# EAGLE design ESPProgrammer (EAGLE 7.7.0)
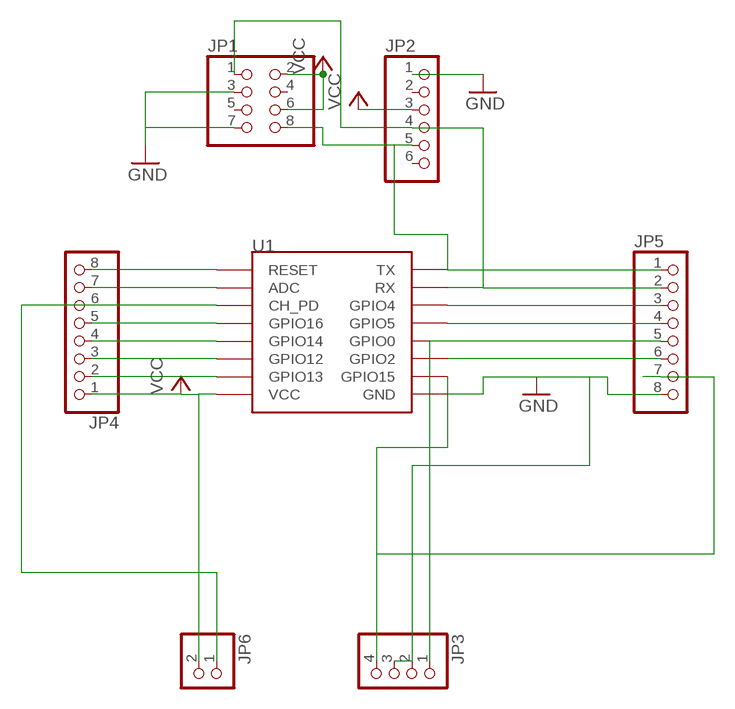
[diagram p0: schematic, sheet 1]

## Parts
JP1  PINHD-2X4  [2X04]
JP2  PINHD-1X6  [1X06]
JP3  PINHD-1X4  [1X04]
JP4  PINHD-1X8  [1X08]
JP5  PINHD-1X8  [1X08]
JP6  PINHD-1X2  [1X02]
U1  ESP12  [ESP12]

## Nets
GND: JP1.3 JP1.7 JP2.1 JP3.2 JP3.3 JP5.8 U1.GND
N$1: JP3.1 JP5.5 U1.GPIO0
N$2: JP3.4 JP5.7 U1.GPIO15
N$3: JP5.3 U1.GPIO4
N$4: JP1.1 JP2.4 JP5.2 U1.RX
N$5: JP1.8 JP2.5 JP5.1 U1.TX
N$6: JP5.4 U1.GPIO5
N$7: JP5.6 U1.GPIO2
N$9: JP4.8 U1.RESET
N$10: JP4.7 U1.ADC
N$11: JP4.5 U1.GPIO16
N$12: JP4.4 U1.GPIO14
N$13: JP4.3 U1.GPIO12
N$14: JP4.2 U1.GPIO13
N$15: JP4.6 JP6.1 U1.CH_PD
VCC: JP1.2 JP1.6 JP2.3 JP4.1 JP6.2 U1.VCC
Unconnected: JP1.4 JP1.5 JP2.2 JP2.6

## Library data of the parts
JP1 = pinhead:PINHD-2X4: PIN HEADER
JP2 = pinhead:PINHD-1X6: PIN HEADER
JP3 = pinhead:PINHD-1X4: PIN HEADER
JP4 JP5 = pinhead:PINHD-1X8: PIN HEADER
JP6 = pinhead:PINHD-1X2: PIN HEADER
U1 = esp8266modules:ESP12: ESP8266 Wifi module 12

## Net classes
0 default: width 0.7 mm, drill 0.6 mm, clearance 0.4 mm

## Board
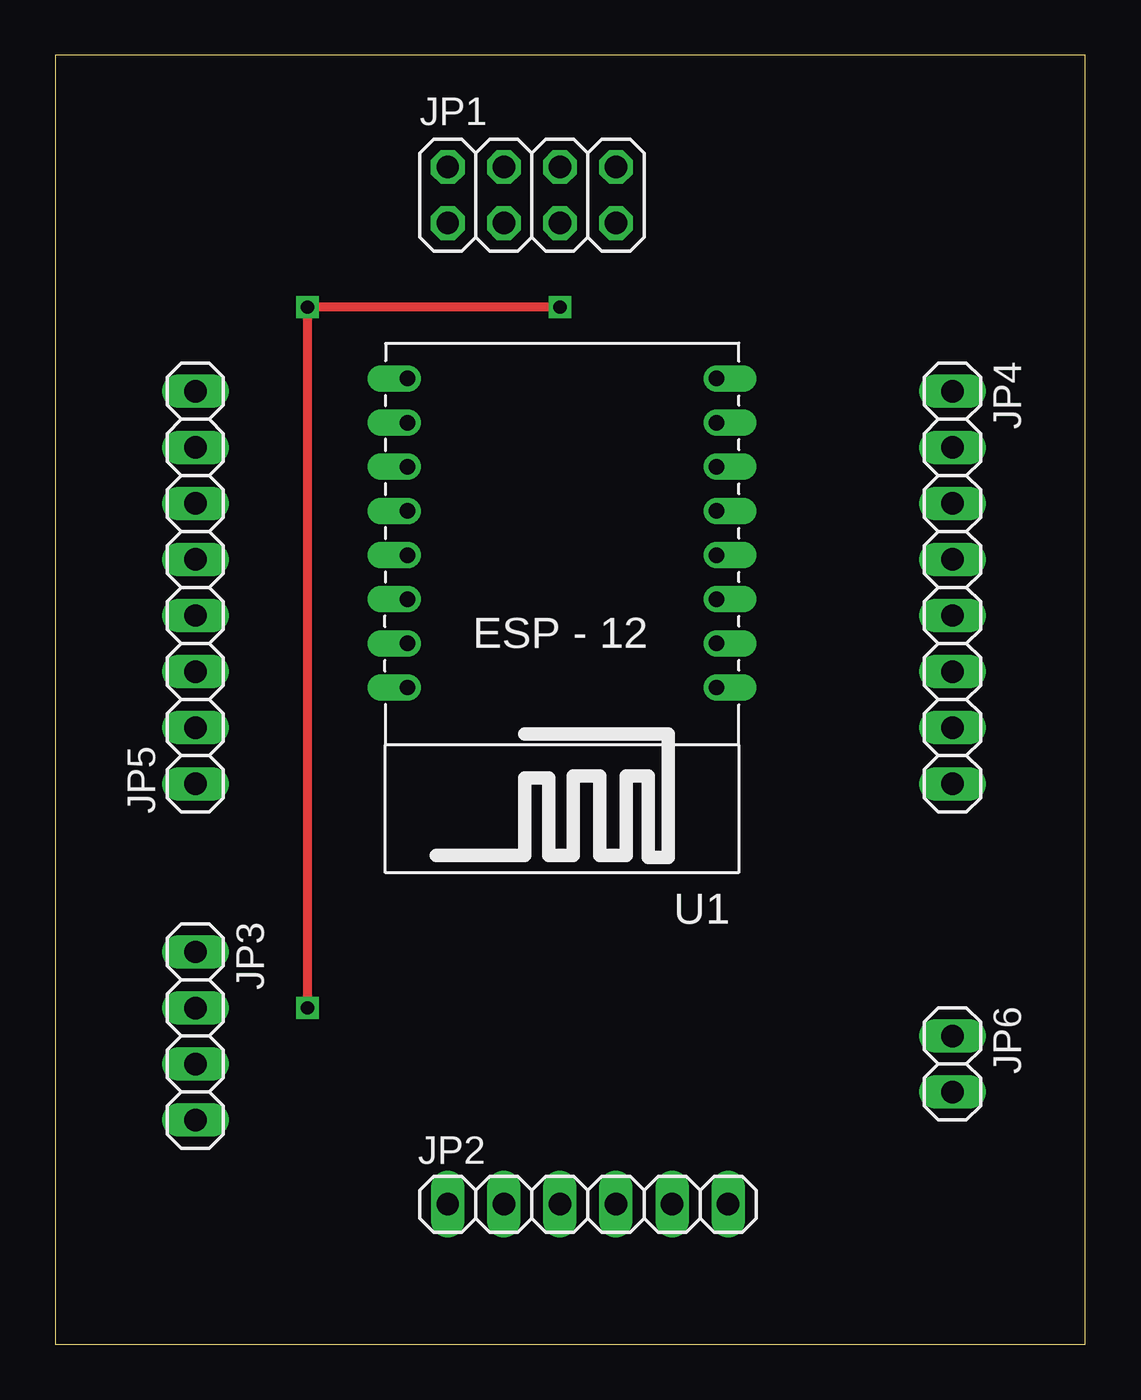
[diagram p1: board, top side]
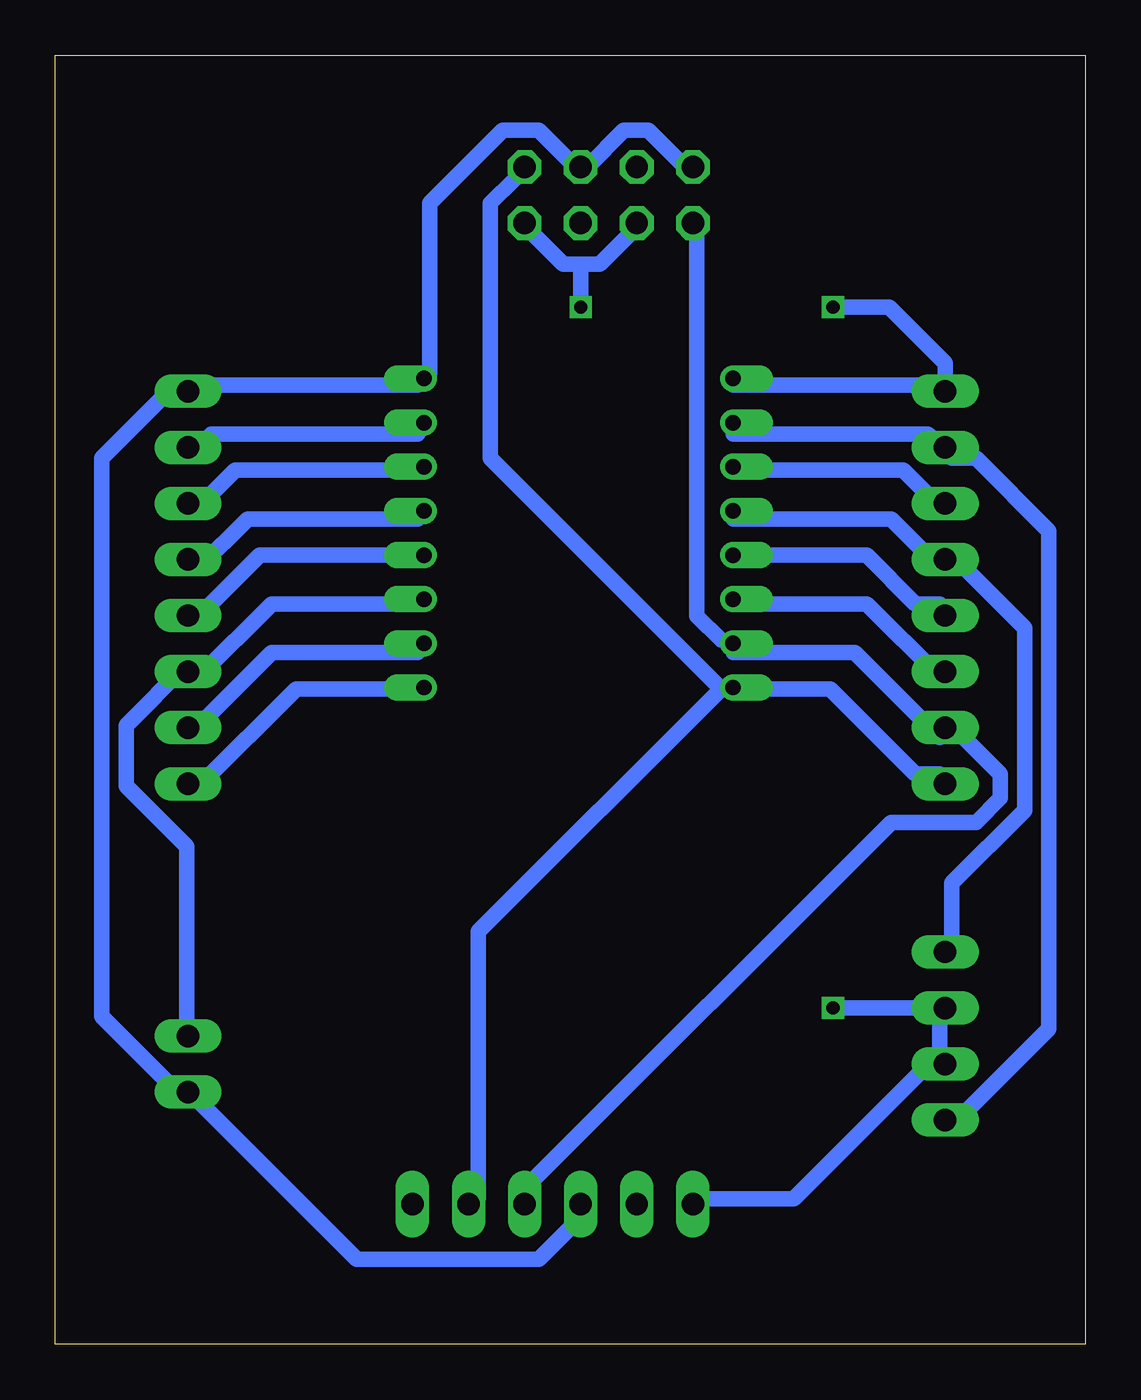
[diagram p2: board, bottom side, seen from below]

Size 46.66 x 58.41 mm. Coordinates in mm from the lower left corner, seen from the top.
Outline: 0,0 46.66,0 46.66,58.41 0,58.41 0,0
Copper layers (1*16): Top 0.035mm / dielectric 1.5mm / Bottom 0.035mm
Design rules "default": minimum track width 10mil, minimum drill 24mil, track to track 8mil, track to pad 8mil, pad to pad 8mil, via to via 8mil, smd to smd 8mil, copper to edge 40mil, drill to drill 8mil, minimum pad ring 10mil, minimum via ring 8mil, stop-mask expansion 4mil, vias tented up to drill 0mil, thermal gap 10mil

### Footprints (pad centres in the part's own frame; a part is rotated, then mirrored left to right if it is on the bottom)
2X04 = drill 1.016 octagon: 1 -3.81,-1.27; 2 -3.81,1.27; 3 -1.27,-1.27; 4 -1.27,1.27; 5 1.27,-1.27; 6 1.27,1.27; 7 3.81,-1.27; 8 3.81,1.27
1X06 = drill 1.016 long: 1 -6.35,0; 2 -3.81,0; 3 -1.27,0; 4 1.27,0; 5 3.81,0; 6 6.35,0
1X04 = drill 1.016 long: 1 -3.81,0; 2 -1.27,0; 3 1.27,0; 4 3.81,0
1X08 = drill 1.016 long: 1 -8.89,0; 2 -6.35,0; 3 -3.81,0; 4 -1.27,0; 5 1.27,0; 6 3.81,0; 7 6.35,0; 8 8.89,0
1X02 = drill 1.016 long: 1 -1.27,0; 2 1.27,0
ESP12 = drill 0.7 offset: ADC -7.1,3.8; CH_PD -7.1,1.8; GND 6.9,-8.2; GPIO0 6.9,-2.2; GPIO2 6.9,-4.2; GPIO4 6.9,1.8; GPIO5 6.9,-0.2; GPIO12 -7.1,-4.2; GPIO13 -7.1,-6.2; GPIO14 -7.1,-2.2; GPIO15 6.9,-6.2; GPIO16 -7.1,-0.2; RESET -7.1,5.8; RX 6.9,3.8; TX 6.9,5.8; VCC -7.1,-8.2

### Placement (x,y rotation side)
JP1  21.59,52.07 0 top
JP2  24.13,6.35 0 top
JP3  6.35,13.97 270 top
JP4  40.64,34.29 270 top
JP5  6.35,34.29 90 top
JP6  40.64,12.7 270 top
U1  22.86,35.56 180 top

### Tracks (layer width: path | path; a pad name or v marks a point on that pad's centre or on a via)
GND  (via drill 0.6)
  Top 0.406: v11.43,15.24 v11.43,46.99 v22.86,46.99
  Bottom 0.406: 22,48.95 22.86,48.95
  Bottom 0.7: 6.6,13.2 6.6,14.85 JP3.2 v11.43,15.24 | 6.6,13.2 13.2,6.6 17.6,6.6 JP2.1 | 6.6,13.2 JP3.3 | U1.GND 15.95,43.45 6.6,43.45 JP5.8 6.35,44.45 8.89,46.99 v11.43,46.99 | JP1.3 20.35,50.6 22,48.95 23.65,48.95 25.3,50.6 JP1.7 | 22.86,48.95 v22.86,46.99
N$1
  Bottom 0.7: U1.GPIO0 15.95,37.4 8.8,37.4 6.6,35.2 JP5.5 6.05,35.75 2.75,32.45 2.75,24.2 6.05,20.9 6.05,18.15 JP3.1
N$2
  Bottom 0.7: U1.GPIO15 15.95,41.25 7.15,41.25 6.6,40.7 JP5.7 6.05,40.15 4.95,40.15 1.65,36.85 1.65,14.3 5.5,10.45 6.05,10.45 JP3.4
N$3
  Bottom 0.7: U1.GPIO4 15.95,33.55 9.9,33.55 6.6,30.25 JP5.3
N$4
  Bottom 0.7: JP1.1 17.6,50.6 17.6,33 16.5,31.9 U1.RX 15.95,31.35 10.45,31.35 6.6,27.5 JP5.2 6.05,28.05 3.85,25.85 3.85,24.75 4.95,23.65 8.8,23.65 25.3,7.15 25.3,6.6 JP2.4
N$5
  Bottom 0.7: JP5.1 6.6,25.85 7.7,25.85 11.55,29.7 15.95,29.7 U1.TX 16.5,29.7 | 16.5,29.7 27.5,18.7 27.5,6.6 JP2.5 | 16.5,29.7 26.95,40.15 26.95,51.7 25.85,52.8 JP1.8
N$6
  Bottom 0.7: U1.GPIO5 9.9,35.75 7.7,33.55 6.6,33.55 JP5.4
N$7
  Bottom 0.7: U1.GPIO2 15.95,39.6 8.25,39.6 6.6,37.95 JP5.6
N$9
  Bottom 0.7: U1.RESET 30.25,29.7 35.75,29.7 40.15,25.3 JP4.8
N$10
  Bottom 0.7: U1.ADC 30.25,31.35 36.85,31.35 40.15,28.05 JP4.7
N$11
  Bottom 0.7: U1.GPIO16 30.25,35.75 37.4,35.75 40.15,33 JP4.5
N$12
  Bottom 0.7: U1.GPIO14 30.25,37.4 37.95,37.4 40.15,35.2 JP4.4
N$13
  Bottom 0.7: U1.GPIO12 30.25,39.6 38.5,39.6 40.15,37.95 JP4.3
N$14
  Bottom 0.7: U1.GPIO13 30.25,41.25 39.6,41.25 40.15,40.7 JP4.2
N$15
  Bottom 0.7: U1.CH_PD 30.25,33.55 36.85,33.55 40.15,30.25 JP4.6 40.7,30.8 43.45,28.05 43.45,25.3 40.7,22.55 40.7,14.3 JP6.1
VCC
  Bottom 0.7: JP2.3 23.1,6.05 23.1,5.5 24.75,3.85 33,3.85 40.15,11 JP6.2 40.7,11.55 41.25,11.55 44.55,14.85 44.55,40.15 41.8,42.9 40.7,42.9 JP4.1 40.15,43.45 30.25,43.45 U1.VCC 29.7,44 29.7,51.7 26.4,55 24.75,55 23.1,53.35 JP1.6 22.55,53.35 20.9,55 19.8,55 18.15,53.35 JP1.2